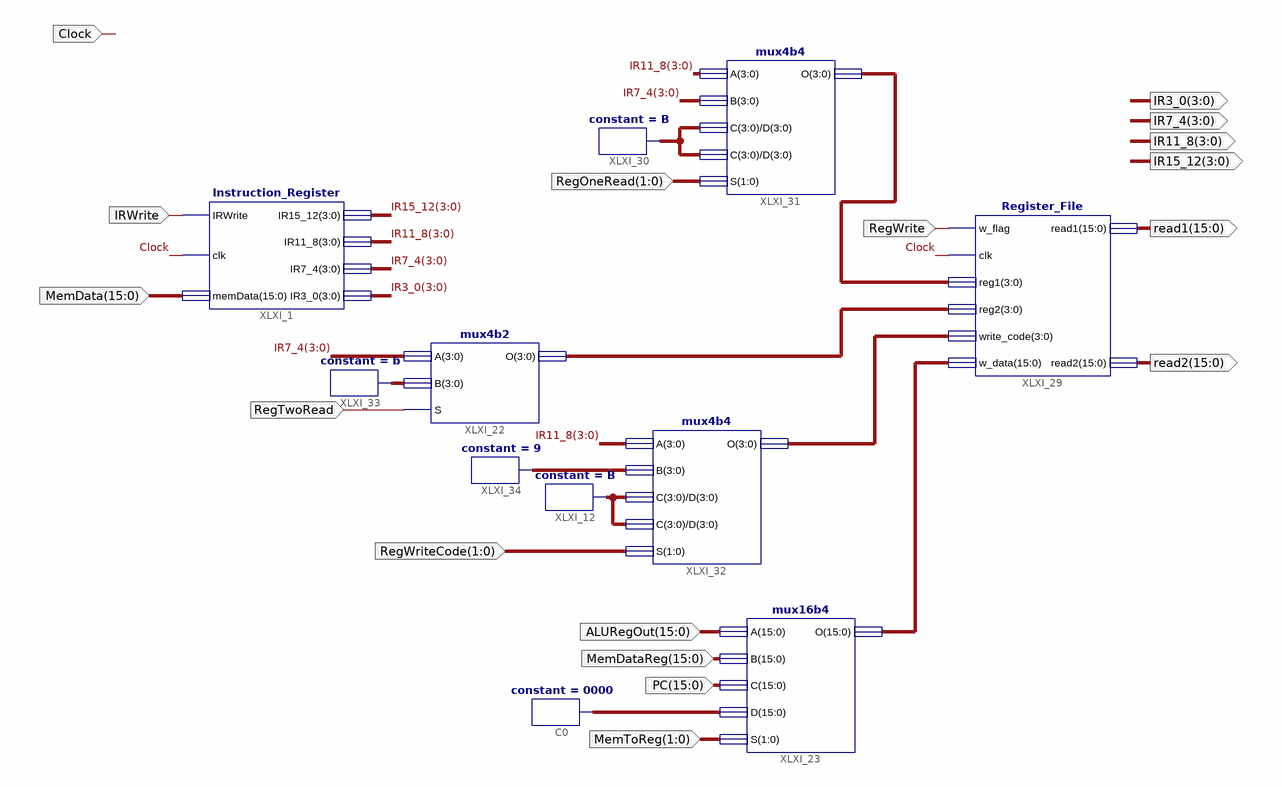
[diagram p0: schematic sheet 1]
// Xilinx ISE schematic InstReg_RegFile.sch (spartan3e) as structural Verilog: 11 symbols, 17 ports
module InstReg_RegFile (
  input  [15:0] MemData,
  input  IRWrite,
  input  [1:0] RegOneRead,
  input  RegWrite,
  input  [1:0] MemToReg,
  input  [15:0] PC,
  input  [15:0] MemDataReg,
  input  [15:0] ALURegOut,
  input  Clock,
  input  [1:0] RegWriteCode,
  input  RegTwoRead,
  output [15:0] read1,
  output [15:0] read2,
  output [3:0] IR3_0,
  output [3:0] IR7_4,
  output [3:0] IR11_8,
  output [3:0] IR15_12
);

  wire [3:0] XLXN_95, XLXN_96, XLXN_97, XLXN_99, XLXN_107, XLXN_109, XLXN_112;
  wire [15:0] XLXN_85, XLXN_101;

  Instruction_Register XLXI_1 (
    .IRWrite(IRWrite), .clk(Clock), .memData(MemData), .IR15_12(IR15_12), .IR11_8(IR11_8), .IR7_4(IR7_4),
    .IR3_0(IR3_0));
  constant #(.CValue("B")) XLXI_12 (.O(XLXN_99));
  mux16b4 XLXI_23 (.A(ALURegOut), .B(MemDataReg), .C(PC), .D(XLXN_101), .S(MemToReg), .O(XLXN_85));
  Register_File XLXI_29 (
    .w_flag(RegWrite), .clk(Clock), .reg1(XLXN_97), .reg2(XLXN_95), .write_code(XLXN_96), .w_data(XLXN_85),
    .read1(read1), .read2(read2));
  constant #(.CValue("B")) XLXI_30 (.O(XLXN_107));
  constant #(.CValue("0000")) C0 (.O(XLXN_101));
  mux4b4 XLXI_31 (.A(IR11_8), .B(IR7_4), .C(XLXN_107), .D(XLXN_107), .S(RegOneRead), .O(XLXN_97));
  mux4b4 XLXI_32 (.A(IR11_8), .B(XLXN_112), .C(XLXN_99), .D(XLXN_99), .S(RegWriteCode), .O(XLXN_96));
  constant #(.CValue("9")) XLXI_34 (.O(XLXN_112));
  constant #(.CValue("b")) XLXI_33 (.O(XLXN_109));
  mux4b2 XLXI_22 (.A(IR7_4), .B(XLXN_109), .S(RegTwoRead), .O(XLXN_95));
endmodule
